# Altium schematic sheet Interface_BUS.SchDoc
size 208 x 43 mm
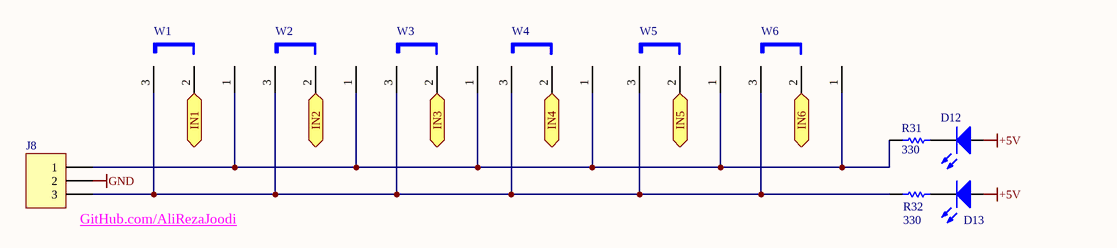
[diagram p0: Interface_BUS.SchDoc]

## Parts
D12  LED  [LED-5mm_Red]  (value not drawn)
D13  LED  [LED-5mm_Red]  (value not drawn)
J8  Header 3  [HDR1X3]  (value not drawn)
R31  value 330  [AXIAL-0.4]  (hidden comment: Resistor)
R32  value 330  [AXIAL-0.4]  (hidden comment: Resistor)
W1  Jumper 3pin  [SIP3]  (value not drawn)
W2  Jumper 3pin  [SIP3]  (value not drawn)
W3  Jumper 3pin  [SIP3]  (value not drawn)
W4  Jumper 3pin  [SIP3]  (value not drawn)
W5  Jumper 3pin  [SIP3]  (value not drawn)
W6  Jumper 3pin  [SIP3]  (value not drawn)

## Ports
IN1, IN2, IN3, IN4, IN5, IN6

## Nets
+5V: D12.1(A) D13.1(A)
GND: J8.2
IN1: W1.2 ; port IN1
IN2: W2.2 ; port IN2
IN3: W3.2 ; port IN3
IN4: W4.2 ; port IN4
IN5: W5.2 ; port IN5
IN6: W6.2 ; port IN6
NetD12_2: D12.2(K) R31.1
NetD13_2: D13.2(K) R32.1
NetJ8_1: J8.1 R31.2 W1.1 W2.1 W3.1 W4.1 W5.1 W6.1
NetJ8_3: J8.3 R32.2 W1.3 W2.3 W3.3 W4.3 W5.3 W6.3

## Notes on the sheet
- (near J8) GitHub.com/AliRezaJoodi

## Library data of the parts
D12 D13 = LED: Typical INFRARED GaAs LED; Manufacturer: Generic Components; Class I: Optoelectronic; Published: 8-Jun-2000; Revision: July-2002: Re-released for DXP Platform.; Publisher: Altium Limited; Class II: LED
J8 = Header 3: Header, 3-Pin; Manufacturer: Generic Components; Class I: Connector; Revision: July-2002: Re-released for DXP Platform.; Publisher: Altium Limited
R31 R32 = Res1: Manufacturer: Generic Components; Class I: Passive; Published: 8-Jun-2000; Revision: July-2002: Re-released for DXP Platform.; Publisher: Altium Limited; Class II: Resistor
W1-W6 = Jumper 3pin: Jumper Wire; Manufacturer: Generic Components; Published: 24-Mar-1999; Revision: July-2002: Re-released for DXP Platform.; Publisher: Altium Limited